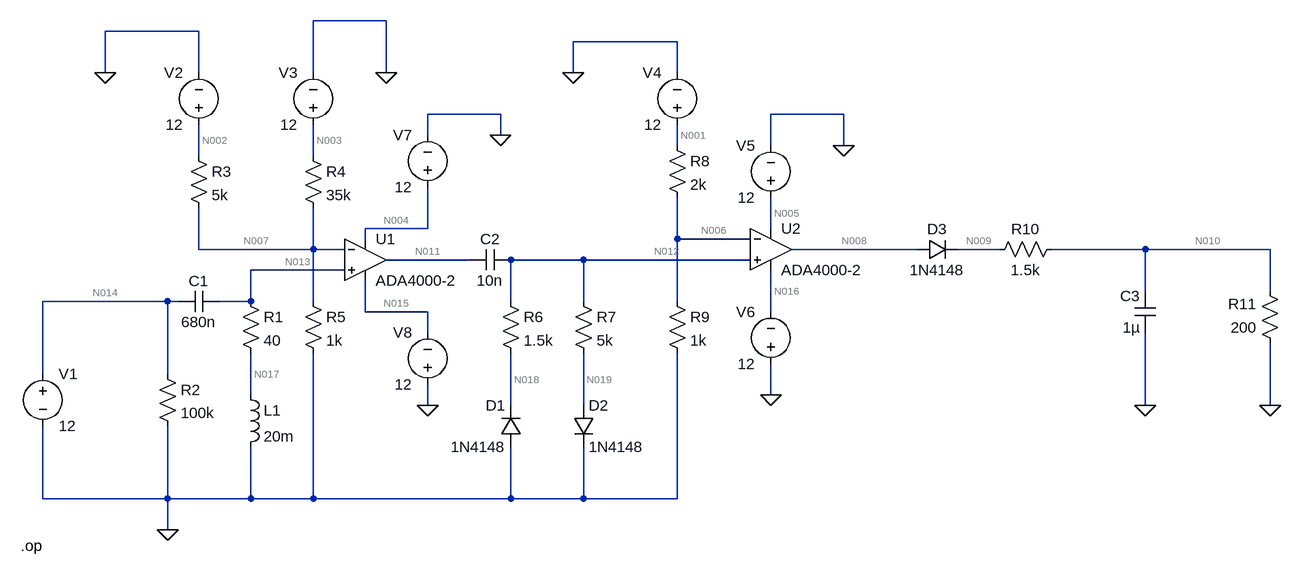
[diagram p0: schematic Problématique.asc]
Problématique.asc, the LTspice schematic file:
Version 4
SHEET 1 1924 680
WIRE 544 -416 432 -416
WIRE 256 -400 112 -400
WIRE 992 -384 832 -384
WIRE 112 -336 112 -400
WIRE 256 -336 256 -400
WIRE 432 -336 432 -416
WIRE 544 -336 544 -416
WIRE 832 -336 832 -384
WIRE 992 -336 992 -384
WIRE 720 -272 608 -272
WIRE 1248 -272 1136 -272
WIRE 608 -240 608 -272
WIRE 720 -240 720 -272
WIRE 992 -224 992 -256
WIRE 1136 -224 1136 -272
WIRE 1248 -224 1248 -272
WIRE 256 -208 256 -256
WIRE 432 -208 432 -256
WIRE 608 -96 608 -160
WIRE 608 -96 512 -96
WIRE 1136 -96 1136 -144
WIRE 512 -80 512 -96
WIRE 992 -80 992 -144
WIRE 1104 -80 992 -80
WIRE 256 -64 256 -128
WIRE 432 -64 432 -128
WIRE 432 -64 256 -64
WIRE 480 -64 432 -64
WIRE 1360 -64 1168 -64
WIRE 1488 -64 1424 -64
WIRE 1712 -64 1568 -64
WIRE 1904 -64 1712 -64
WIRE 672 -48 544 -48
WIRE 848 -48 736 -48
WIRE 1104 -48 848 -48
WIRE 480 -32 336 -32
WIRE 1712 0 1712 -64
WIRE 1904 0 1904 -64
WIRE 208 16 16 16
WIRE 224 16 208 16
WIRE 336 16 336 -32
WIRE 336 16 288 16
WIRE 432 16 432 -64
WIRE 736 16 736 -48
WIRE 848 16 848 -48
WIRE 992 16 992 -80
WIRE 512 32 512 -16
WIRE 608 32 512 32
WIRE 1136 32 1136 -32
WIRE 608 64 608 32
WIRE 16 128 16 16
WIRE 208 128 208 16
WIRE 336 160 336 96
WIRE 1136 160 1136 112
WIRE 608 176 608 144
WIRE 736 176 736 96
WIRE 848 176 848 96
WIRE 1712 176 1712 64
WIRE 1904 176 1904 80
WIRE 16 320 16 208
WIRE 208 320 208 208
WIRE 208 320 16 320
WIRE 336 320 336 240
WIRE 336 320 208 320
WIRE 432 320 432 96
WIRE 432 320 336 320
WIRE 736 320 736 240
WIRE 736 320 432 320
WIRE 848 320 848 240
WIRE 848 320 736 320
WIRE 992 320 992 96
WIRE 992 320 848 320
WIRE 208 368 208 320
FLAG 1712 176 0
FLAG 1904 176 0
FLAG 208 368 0
FLAG 544 -336 0
FLAG 112 -336 0
FLAG 832 -336 0
FLAG 1248 -224 0
FLAG 1136 160 0
FLAG 608 176 0
FLAG 720 -240 0
SYMBOL voltage 16 112 R0
SYMATTR InstName V1
SYMATTR Value 12
SYMBOL res 320 0 R0
SYMATTR InstName R1
SYMATTR Value 40
SYMBOL res 192 112 R0
SYMATTR InstName R2
SYMATTR Value 100k
SYMBOL res 240 -224 R0
SYMATTR InstName R3
SYMATTR Value 5k
SYMBOL res 416 -224 R0
SYMATTR InstName R4
SYMATTR Value 35k
SYMBOL res 416 0 R0
SYMATTR InstName R5
SYMATTR Value 1k
SYMBOL res 720 0 R0
SYMATTR InstName R6
SYMATTR Value 1.5k
SYMBOL res 832 0 R0
SYMATTR InstName R7
SYMATTR Value 5k
SYMBOL res 976 -240 R0
SYMATTR InstName R8
SYMATTR Value 2k
SYMBOL res 976 0 R0
SYMATTR InstName R9
SYMATTR Value 1k
SYMBOL res 1584 -80 R90
WINDOW 0 0 56 VBottom 2
WINDOW 3 32 56 VTop 2
SYMATTR InstName R10
SYMATTR Value 1.5k
SYMBOL res 1920 96 R180
WINDOW 0 36 76 Left 2
WINDOW 3 36 40 Left 2
SYMATTR InstName R11
SYMATTR Value 200
SYMBOL ind 320 144 R0
SYMATTR InstName L1
SYMATTR Value 20m
SYMBOL cap 288 0 R90
WINDOW 0 0 32 VBottom 2
WINDOW 3 32 32 VTop 2
SYMATTR InstName C1
SYMATTR Value 680n
SYMBOL cap 736 -64 R90
WINDOW 0 0 32 VBottom 2
WINDOW 3 32 32 VTop 2
SYMATTR InstName C2
SYMATTR Value 10n
SYMBOL cap 1728 64 R180
WINDOW 0 24 56 Left 2
WINDOW 3 24 8 Left 2
SYMATTR InstName C3
SYMATTR Value 1µ
SYMBOL diode 752 240 R180
WINDOW 0 24 64 Left 2
WINDOW 3 24 0 Left 2
SYMATTR InstName D1
SYMATTR Value 1N4148
SYMBOL diode 832 176 R0
SYMATTR InstName D2
SYMATTR Value 1N4148
SYMBOL diode 1360 -48 R270
WINDOW 0 32 32 VTop 2
WINDOW 3 0 32 VBottom 2
SYMATTR InstName D3
SYMATTR Value 1N4148
SYMBOL OpAmps\\ADA4000-2 512 -112 R0
SYMATTR InstName U1
SYMBOL OpAmps\\ADA4000-2 1136 -128 R0
SYMATTR InstName U2
SYMBOL voltage 256 -240 R180
WINDOW 0 24 96 Left 2
WINDOW 3 24 16 Left 2
SYMATTR InstName V2
SYMATTR Value 12
SYMBOL voltage 432 -240 R180
WINDOW 0 24 96 Left 2
WINDOW 3 24 16 Left 2
SYMATTR InstName V3
SYMATTR Value 12
SYMBOL voltage 992 -240 R180
WINDOW 0 24 96 Left 2
WINDOW 3 24 16 Left 2
SYMATTR InstName V4
SYMATTR Value 12
SYMBOL voltage 1136 -128 R180
WINDOW 0 24 96 Left 2
WINDOW 3 24 16 Left 2
SYMATTR InstName V5
SYMATTR Value 12
SYMBOL voltage 1136 128 R180
WINDOW 0 24 96 Left 2
WINDOW 3 24 16 Left 2
SYMATTR InstName V6
SYMATTR Value 12
SYMBOL voltage 608 -144 R180
WINDOW 0 24 96 Left 2
WINDOW 3 24 16 Left 2
SYMATTR InstName V7
SYMATTR Value 12
SYMBOL voltage 608 160 R180
WINDOW 0 24 96 Left 2
WINDOW 3 24 16 Left 2
SYMATTR InstName V8
SYMATTR Value 12
TEXT -18 392 Left 2 !.op

The netlist it stands for:
* Problématique.asc
V1 N014 0 12
R1 N013 N017 40
R2 N014 0 100k
R3 N002 N007 5k
R4 N003 N007 35k
R5 N007 0 1k
R6 N012 N018 1.5k
R7 N012 N019 5k
R8 N001 N006 2k
R9 N006 0 1k
R10 N010 N009 1.5k
R11 0 N010 200
L1 N017 0 20m
C1 N013 N014 680n
C2 N012 N011 10n
C3 0 N010 1µ
D1 0 N018 1N4148
D2 N019 0 1N4148
D3 N008 N009 1N4148
XU1 N013 N007 N004 N015 N011 ADA4000-2  ; pins In+ In- V+ V- OUT
XU2 N012 N006 N005 N016 N008 ADA4000-2  ; pins In+ In- V+ V- OUT
V2 N002 0 12
V3 N003 0 12
V4 N001 0 12
V5 N005 0 12
V6 0 N016 12
V7 N004 0 12
V8 0 N015 12
.model D D
.lib standard.dio
.op
.backanno
.end

* Results of the author's LTspice run, read from the files saved beside the schematic
* Operating Point:
*   V(n014) = 12 V
*   V(n013) = 8.642 nV
*   V(n017) = 216 fV
*   V(n002) = 12 V
*   V(n007) = 2.233 V
*   V(n003) = 12 V
*   V(n012) = 3.51 mV
*   V(n018) = 3.51 mV
*   V(n019) = 3.509 mV
*   V(n001) = 12 V
*   V(n006) = 4 V
*   V(n010) = -506.2 nV
*   V(n009) = -4.303 µV
*   V(n011) = -11 V
*   V(n008) = -11 V
*   V(n004) = 12 V
*   V(n015) = -12 V
*   V(n005) = 12 V
*   V(n016) = -12 V
*   I(C3) = 0 A
*   I(C2) = 0 A
*   I(C1) = 0 A
*   I(D3) = -2.531 nA
*   I(D2) = 202.9 pA
*   I(D1) = -187.8 pA
*   I(L1) = 216 pA
*   I(R11) = 2.531 nA
*   I(R10) = 2.531 nA
*   I(R9) = 4 mA
*   I(R8) = 4 mA
*   I(R7) = 202.9 pA
*   I(R6) = 187.8 pA
*   I(R5) = 2.233 mA
*   I(R4) = 279.1 µA
*   I(R3) = 1.953 mA
*   I(R2) = 120 µA
*   I(R1) = 216 pA
*   I(V8) = -1.325 mA
*   I(V7) = -1.433 mA
*   I(V6) = -1.323 mA
*   I(V5) = -1.433 mA
*   I(V4) = -4 mA
*   I(V3) = -279.1 µA
*   I(V2) = -1.953 mA
*   I(V1) = -120 µA
*   Ix(u1:1) = -216 pA
*   Ix(u1:2) = 227.2 pA
*   Ix(u1:3) = 1.433 mA
*   Ix(u1:4) = -1.325 mA
*   Ix(u1:5) = 21.99 pA
*   Ix(u2:1) = -390.7 pA
*   Ix(u2:2) = 402.7 pA
*   Ix(u2:3) = 1.433 mA
*   Ix(u2:4) = -1.323 mA
*   Ix(u2:5) = 2.553 nA
* From the log:
*   Semiconductor Device Operating Points:
*                           --- Diodes ---
*   Name:    d:u2:2      d:u2:4      d:u2:3      d:u2:6      d:u2:1
*   Model:    u2:iq       u2:x2       u2:x1       u2:y        u2:y
*   Id:      3.50e-04    1.10e-04   -2.30e-10    2.30e-19   -2.30e-19
*   Vd:      2.40e+01   -1.00e+00   -2.30e+01    2.30e-07   -2.30e-07
*   Req:     5.00e-04    5.00e-04    1.00e-11    1.00e-12    1.00e-12
*   CAP:     0.00e+00    0.00e+00    0.00e+00    0.00e+00    0.00e+00
*   Name:    d:u1:2      d:u1:4      d:u1:3      d:u1:6      d:u1:1
*   Model:    u1:iq       u1:x2       u1:x1       u1:y        u1:y
*   Id:      3.50e-04    1.08e-04   -2.30e-10    3.93e-21   -3.93e-21
*   Vd:      2.40e+01   -1.00e+00   -2.30e+01    3.92e-09   -3.92e-09
*   Req:     5.00e-04    5.00e-04    1.00e-11    1.00e-12    1.00e-12
*   CAP:     0.00e+00    0.00e+00    0.00e+00    0.00e+00    0.00e+00
*   Name:      d3          d2          d1
*   Model:   1n4148      1n4148      1n4148
*   Id:     -2.53e-09    2.03e-10   -1.88e-10
*   Vd:     -1.10e+01    3.51e-03   -3.51e-03
*   Req:     1.00e+12    1.66e+07    1.94e+07
*   CAP:     1.48e-12    4.01e-12    4.00e-12
*                           --- VDMOSFET Transistors ---
*   Name:        m:u2:2      m:u2:1      m:u1:2      m:u1:1
*   Model:        u2:p        u2:n        u1:p        u1:n
*   Id:         -1.08e-03    1.08e-03   -1.08e-03    1.08e-03
*   Vgs:        -2.30e-07   -2.30e-07   -3.92e-09   -3.92e-09
*   Vds:        -1.00e+00    2.30e+01   -1.00e+00    2.30e+01
*   Vth:         2.50e-01   -2.50e-01    2.50e-01   -2.50e-01
*   Gm:          5.60e-03    5.60e-03    5.60e-03    5.60e-03
*   Gds:         0.00e+00    0.00e+00    0.00e+00    0.00e+00
*   Cgs:         0.00e+00    0.00e+00    0.00e+00    0.00e+00
*   Cgd:         0.00e+00    0.00e+00    0.00e+00    0.00e+00
*   Cbody:       0.00e+00    0.00e+00    0.00e+00    0.00e+00